# EAGLE schematic raspberry Pi to arduino (EAGLE 9.4.0)
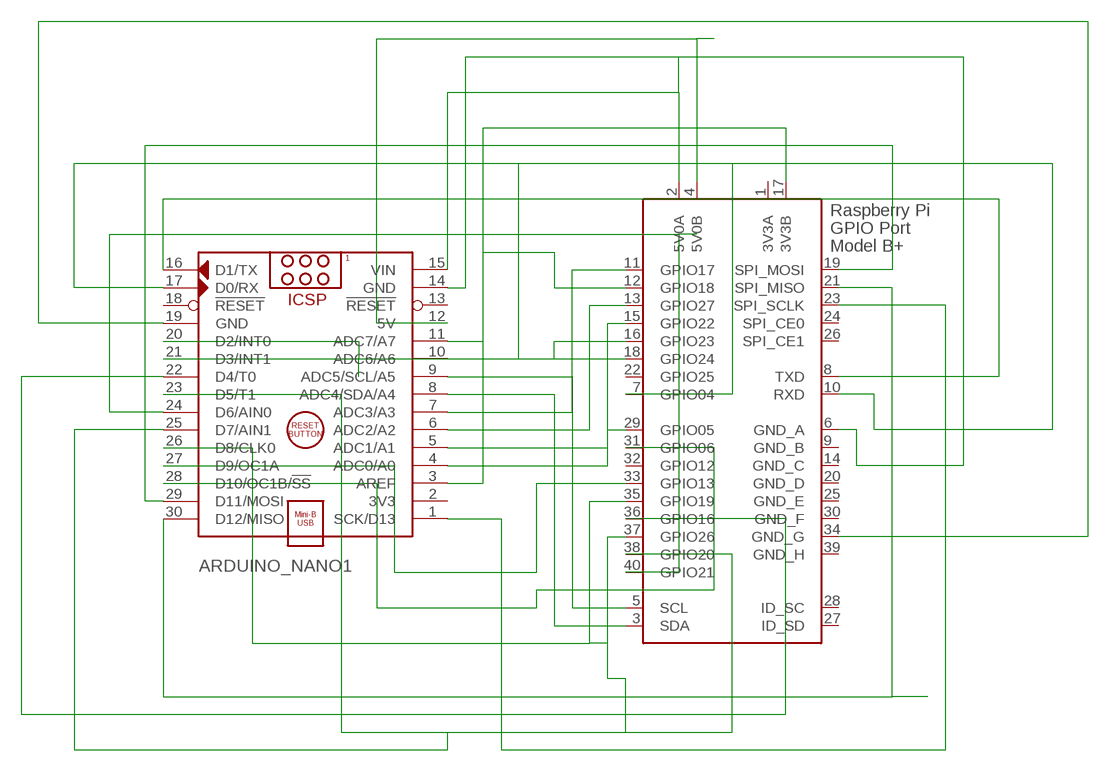
[diagram p0: schematic, sheet 1]

## Parts
ARDUINO_NANO1  ARDUINO_NANO  [ARDUINO_NANO]
X1  RASPI_GPIO_B+#_PIN  [RASPI_GPIO_B+_PIN]

## Nets
N$1: ARDUINO_NANO1.15(VIN) X1.2(5V0A)
N$2: ARDUINO_NANO1.9(ADC5/SCL/A5) X1.5(SCL)
N$3: ARDUINO_NANO1.8(ADC4/SDA/A4) X1.3(SDA)
N$4: ARDUINO_NANO1.7(ADC3/A3) X1.11(GPIO17)
N$5: ARDUINO_NANO1.6(ADC2/A2) X1.13(GPIO27)
N$6: ARDUINO_NANO1.5(ADC1/A1) X1.15(GPIO22)
N$7: ARDUINO_NANO1.30(D12/MISO) X1.21(SPI_MISO)
N$8: ARDUINO_NANO1.29(D11/MOSI) X1.19(SPI_MOSI)
N$9: ARDUINO_NANO1.1(SCK/D13) X1.23(SPI_SCLK)
N$10: ARDUINO_NANO1.4(ADC0/A0) X1.29(GPIO05)
N$11: ARDUINO_NANO1.10(ADC6/A6) X1.7(GPIO04)
N$12: ARDUINO_NANO1.28(D10/OC1B/!SS) X1.31(GPIO06)
N$13: ARDUINO_NANO1.27(D9/OC1A) X1.33(GPIO13)
N$14: ARDUINO_NANO1.26(D8/CLK0) X1.35(GPIO19)
N$15: ARDUINO_NANO1.25(D7/AIN1) X1.37(GPIO26)
N$16: ARDUINO_NANO1.24(D6/AIN0) X1.40(GPIO21)
N$17: ARDUINO_NANO1.23(D5/T1) X1.38(GPIO20)
N$18: ARDUINO_NANO1.22(D4/T0) X1.36(GPIO16)
N$19: ARDUINO_NANO1.21(D3/INT1) X1.16(GPIO23)
N$20: ARDUINO_NANO1.20(D2/INT0) X1.18(GPIO24)
N$21: ARDUINO_NANO1.16(D1/TX) X1.8(TXD)
N$22: ARDUINO_NANO1.17(D0/RX) X1.10(RXD)
N$23: ARDUINO_NANO1.11(ADC7/A7) X1.12(GPIO18)
N$24: ARDUINO_NANO1.3(AREF) X1.17(3V3B)
N$25: ARDUINO_NANO1.12(5V) X1.4(5V0B)
N$26: ARDUINO_NANO1.19(GND) X1.34(GND_G)
N$27: ARDUINO_NANO1.14(GND) X1.6(GND_A)
Unconnected: ARDUINO_NANO1.2(3V3) ARDUINO_NANO1.13(!RESET) ARDUINO_NANO1.18(!RESET) X1.22(GPIO25) X1.24(SPI_CE0) X1.26(SPI_CE1) X1.27(ID_SD) X1.28(ID_SC) X1.32(GPIO12)

## Power pins joined to a net without a drawn wire
3V3A: X1.1(3V3A)
GND_B: X1.9(GND_B)
GND_C: X1.14(GND_C)
GND_D: X1.20(GND_D)
GND_E: X1.25(GND_E)
GND_F: X1.30(GND_F)
GND_H: X1.39(GND_H)

## Library data of the parts
ARDUINO_NANO1 = ArduinoNanoV30:ARDUINO_NANO: Arduino Nano V3.0 Module Overview: The Arduino Nano is a small, complete, and breadboard-friendly board based on the ATmega328 (Arduino Nano 3.x) or ATmega168 (Arduino Nano 2.x). It has more or less the same functionality of the Arduino Duemilanove, but in a different package. It lacks only a DC power jack, and works with a Mini-B USB cable instead of a standard one. The Nano was designed and is being produced by Gravitech <http://www.gravitech.us/arna30wiatp.html>. General specifications: Item Value Microcontroller Atmel ATmega168 or ATmega328 Operating Voltage (logic level) 5 V Input Voltage (recommended) 7-12 V Input Voltage (limits) 6-20 V Digital I/O Pins 14 (of which 6 provide PWM output) Analog Input Pins 8 DC Current per I/O Pin 40 mA Flash Memory 16 KB (ATmega168) or 32 KB (ATmega328) of which 2 KB used by bootloader SRAM 1 KB (ATmega168) or 2 KB (ATmega328) EEPROM 512 bytes (ATmega168) or 1 KB (ATmega328) Clock Speed 16 MHz Dimensions (Inches) 0.73" x 1.70" Dimensions (mm) 18mm x 45mm Overall height About 9 mm (not including pins) Weigth 5 g Power: The Arduino Nano can be powered via the Mini-B USB connection, 6-20V unregulated external power supply (pin 30), or 5V regulated external power supply (pin 27). The power source is automatically selected to the highest voltage source. Memory: The ATmega168 has 16 KB of flash memory for storing code (of which 2 KB is used for the bootloader); the ATmega328 has 32 KB, (also with 2 KB used for the bootloader). The ATmega168 has 1 KB of SRAM and 512 bytes of EEPROM (which can be read and written with the EEPROM library); the ATmega328 has 2 KB of SRAM and 1 KB of EEPROM. Input and Output: Each of the 14 digital pins on the Nano can be used as an input or output, using pinMode(), digitalWrite(), and digitalRead() functions. They operate at 5 volts. Each pin can provide or receive a maximum of 40 mA and has an internal pull-up resistor (disconnected by default) of 20-50 kOhms. In addition, some pins have specialized functions. Visit Arduino - ArduinoBoardNano <https://www.arduino.cc/en/Main/ArduinoBoardNano>
X1 = raspberrypi_bastelstube_v13:RASPI_GPIO_B+#: 2x20 header connector, all pins connected